# Altium schematic sheet Power Supplies.SchDoc: Nixie Clock Power Supply
size A4; DrawnBy: Thorben Zethoff; Revision: 1.0; SheetNumber: 1
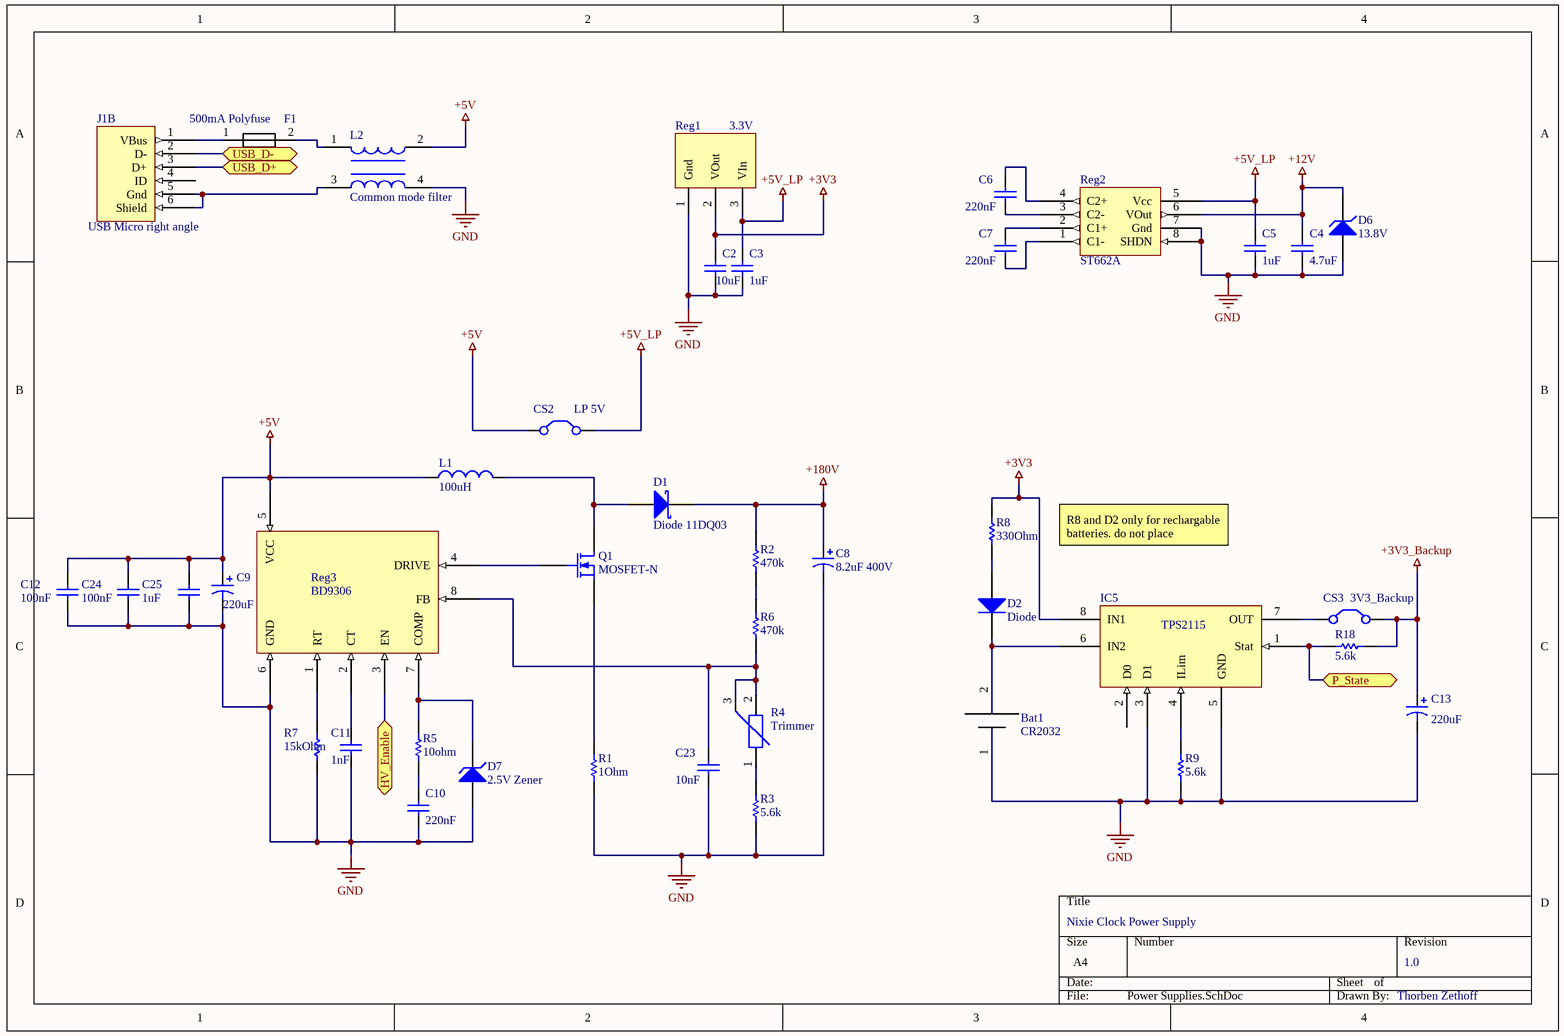
[diagram p0: Power Supplies.SchDoc]

## Parts
Bat1  CR2032  [BU2032SM]
C2  10uF  [0603]
C3  1uF  [0603]
C4  4.7uF  [0603]
C5  1uF  [0603]
C6  220nF  [0603]
C7  220nF  [0603]
C8  8.2uF 400V  [10x10 SMD Electrolytic]
C9  220uF  [2917 Tantalum]
C10  220nF  [0603]
C11  1nF  [0603]
C12  100nF  [0603]
C13  220uF  [2917 Tantalum]
C23  10nF  [0603]
C24  100nF  [0603]
C25  1uF  [0603]
CS2  LP 5V  [Solder Jumper]
CS3  3V3_Backup  [Solder Jumper]
D1  Diode 11DQ03  [DO-214]
D2  Diode  [SOD523]
D6  13.8V  [SOD523]
D7  2.5V Zener  [SOD523]
F1  500mA Polyfuse  [0805]
IC5  TPS2115  [VSON 3.1x3.1]  (value not drawn)
J1B  USB Micro right angle  [USB 2.0 Type b micro]
L1  100uH  [DR127 Eaton]
L2  Common mode filter  [SON127P600 4 POS (8.50mm x 5.60mm)]
Q1  MOSFET-N  [TO252]
R1  1Ohm  [1206]
R2  470k  [1206]
R3  5.6k  [0603]
R4  Trimmer  [SM-42 Trimmer]
R5  10ohm  [0603]
R6  470k  [1206]
R7  15kOhm  [0603]
R8  330Ohm  [0603]
R9  5.6k  [0603]
R18  5.6k  [0603]
Reg1  3.3V  [SOT223]
Reg2  ST662A  [SOIC8]
Reg3  BD9306  [MSOP8]

## Ports
HV_Enable (bidir), P_State (bidir), USB_D+ (bidir), USB_D- (bidir)

## Nets
+3V3: C2.1 IC5.8(IN1) R8.1 Reg1.2(VOut)
+3V3_Backup: C13.1 CS3.2(C2) R18.1
+5V: C9.1 C12.1 C24.1 C25.1 CS2.1(C1) L1.1 L2.2 Reg3.5(VCC)
+5V_LP: C3.1 C5.1 CS2.2(C2) Reg1.3(VIn) Reg2.5(Vcc)
+12V: C4.1 D6.2(K) Reg2.6(VOut)
+180V: C8.1 D1.2(K) R2.1
GND: Bat1.1(-) C2.2 C3.2 C4.2 C5.2 C8.2 C9.2 C10.2 C11.2 C12.2 C13.2 C23.2 C24.2 C25.2 D6.1(A) D7.1(A) IC5.3(D1) IC5.5(GND) L2.4 R1.2 R3.2 R7.2 R9.2 Reg1.1(Gnd) Reg2.7(Gnd) Reg2.8(SHDN) Reg3.6(GND)
HV_Enable: Reg3.3(EN) ; port HV_Enable
P_State: IC5.1(Stat) R18.2 ; port P_State
USB_D+: J1B.3(D+) ; port USB_D+
USB_D-: J1B.2(D-) ; port USB_D-
NetBat1_2: Bat1.2(+) D2.2(K) IC5.6(IN2)
NetC6_1: C6.1 Reg2.4(C2+)
NetC6_2: C6.2 Reg2.3(C2-)
NetC7_1: C7.1 Reg2.2(C1+)
NetC7_2: C7.2 Reg2.1(C1-)
NetC10_1: C10.1 R5.2
NetC11_1: C11.1 Reg3.2(CT)
NetC23_1: C23.1 R4.2 R4.3 R6.2 Reg3.8(FB)
NetCS3_1: CS3.1(C1) IC5.7(OUT)
NetD1_1: D1.1(A) L1.2 Q1.1(D)
NetD2_1: D2.1(A) R8.2
NetD7_2: D7.2(K) R5.1 Reg3.7(COMP)
NetF1_1: F1.1 J1B.1(VBus)
NetF1_2: F1.2 L2.1
NetIC5_4: IC5.4(ILim) R9.1
NetJ1B_5: J1B.5(Gnd) J1B.6(Shield) L2.3
NetQ1_2: Q1.2(G) Reg3.4(DRIVE)
NetQ1_3: Q1.3(S) R1.1
NetR2_2: R2.2 R6.1
NetR3_1: R3.1 R4.1
NetR7_1: R7.1 Reg3.1(RT)

Not connected (* = marked no-connect by the designer): IC5 2(D0); J1B 4(ID)

## Notes on the sheet
- R8 and D2 only for rechargable batteries. do not place

## Library data of the parts
Bat1 = Battery
C2-C7 C10-C12 C23-C25 = Cap: Capacitor; Published: 8-Jun-2000; LatestRevisionDate: 17-Jul-2002; LatestRevisionNote: Re-released for DXP Platform.; PackageReference: RAD-0.3; Publisher: Altium Limited; PackageDescription: Radial Cap, Thru-Hole; 2 Leads; 0.3 in Pin Spacing
C8 = Cap Pol1: Published: 8-Jun-2000; LatestRevisionDate: 17-Jul-2002; LatestRevisionNote: Re-released for DXP Platform.; PackageReference: RB7.6-15; Publisher: Altium Limited; PackageDescription: Polarized Capacitor (Radial); 2 Leads
C9 C13 = Cap Pol1: Tantalum; Published: 8-Jun-2000; LatestRevisionDate: 17-Jul-2002; LatestRevisionNote: Re-released for DXP Platform.; PackageReference: RB7.6-15; Publisher: Altium Limited; PackageDescription: Polarized Capacitor (Radial); 2 Leads
CS2 = Jumper: Published: 24-Mar-1999; LatestRevisionDate: 17-Jul-2002; LatestRevisionNote: Re-released for DXP Platform.; PackageReference: RAD-0.2; Publisher: Altium Limited; PackageDescription: Radial Cap, Thru-Hole; 2 Leads; 0.2 in Pin Spacing
CS3 = Jumper: I2C Passthrough; Published: 24-Mar-1999; LatestRevisionDate: 17-Jul-2002; LatestRevisionNote: Re-released for DXP Platform.; PackageReference: RAD-0.2; Publisher: Altium Limited; PackageDescription: Radial Cap, Thru-Hole; 2 Leads; 0.2 in Pin Spacing
D1 = Diode 11DQ03: Schottky Rectifier; pin to pad: 1>2 2>1; Published: 8-Jun-2000; LatestRevisionDate: 17-Jul-2002; LatestRevisionNote: Re-released for DXP Platform.; DatasheetVersion: Dec-1997; PackageReference: DO-204AL; Publisher: Altium Limited; PackageDescription: Diode, Axial; Body 5.2 x 2.7 mm (LxDia. max), Lead Dia. 0.86 mm (max); Code_JEDEC: DO-204-AL; ComponentLink1Description: Manufacturer Link; ComponentLink1URL: http://www.irf.com/; ComponentLink2Description: Datasheet; ComponentLink2URL: http://www.irf.com/product-info/datasheets/data/11dq03.pdf
D2 = Diode: Default Diode; pin to pad: 1>2 2>1; Published: 8-Jun-2000; LatestRevisionDate: 17-Jul-2002; LatestRevisionNote: Re-released for DXP Platform.; PackageVersion: Sep-1996; PackageReference: SMC; Publisher: Altium Limited; PackageDescription: DO-214-AB/SMC; 2 C-Bend Leads; Body 7.9 x 5.9 mm, inc. leads (LxW); Code_JEDEC: DO-214-AB
D6 D7 = D Zener: Zener Diode; Published: 8-Jun-2000; LatestRevisionDate: 17-Jul-2002; LatestRevisionNote: Re-released for DXP Platform.; PackageReference: DIODE-0.7; Publisher: Altium Limited; PackageDescription: Diode, Thru-Hole; 2 Leads; 0.7 in Pin Spacing
F1 = Fuse: Fuse OR PTC Resettable Fuse
J1B = USB 2.0 Type B Micro
L1 = Inductor: Code_IEC: 1005; Published: 8-Jun-2000; LatestRevisionDate: 29-May-2009; LatestRevisionNote: IPC-7351 Footprint Added.; PackageReference: 0402-A; Publisher: Altium Limited; PackageDescription: Chip Inductor; Code_JEITA: 0402
L2 = Common mode filter: pin to pad: 2>4 3>2 4>3
Q1 = MOSFET-N: N-Channel MOSFET; pin to pad: 1>2 2>1; Published: 8-Jun-2000; LatestRevisionDate: 17-Jul-2002; LatestRevisionNote: Re-released for DXP Platform.; PackageVersion: 1995/1996; PackageReference: E3; Publisher: Altium Limited; PackageDescription: TO, Flat Index; 3 In-Line, Axial Leads; Body Dia. 4.6mm; Lead Dia. 0.5 mm (max)
R1 R2 R5-R8 = Res1: Resistor; Published: 8-Jun-2000; LatestRevisionDate: 17-Jul-2002; LatestRevisionNote: Re-released for DXP Platform.; PackageReference: AXIAL-0.3; Publisher: Altium Limited; PackageDescription: Axial Device, Thru-Hole; 2 Leads; 0.3 in Pin Spacing
R3 R9 R18 = Res1: Published: 8-Jun-2000; LatestRevisionDate: 17-Jul-2002; LatestRevisionNote: Re-released for DXP Platform.; PackageReference: AXIAL-0.3; Publisher: Altium Limited; PackageDescription: Axial Device, Thru-Hole; 2 Leads; 0.3 in Pin Spacing
Reg1 = VReg
Reg2 = ST662A: 12V Boosting charge pump